# Altium schematic sheet one_planar_sensor_connector_hall_crossboard_1_1.SchDoc
size A3
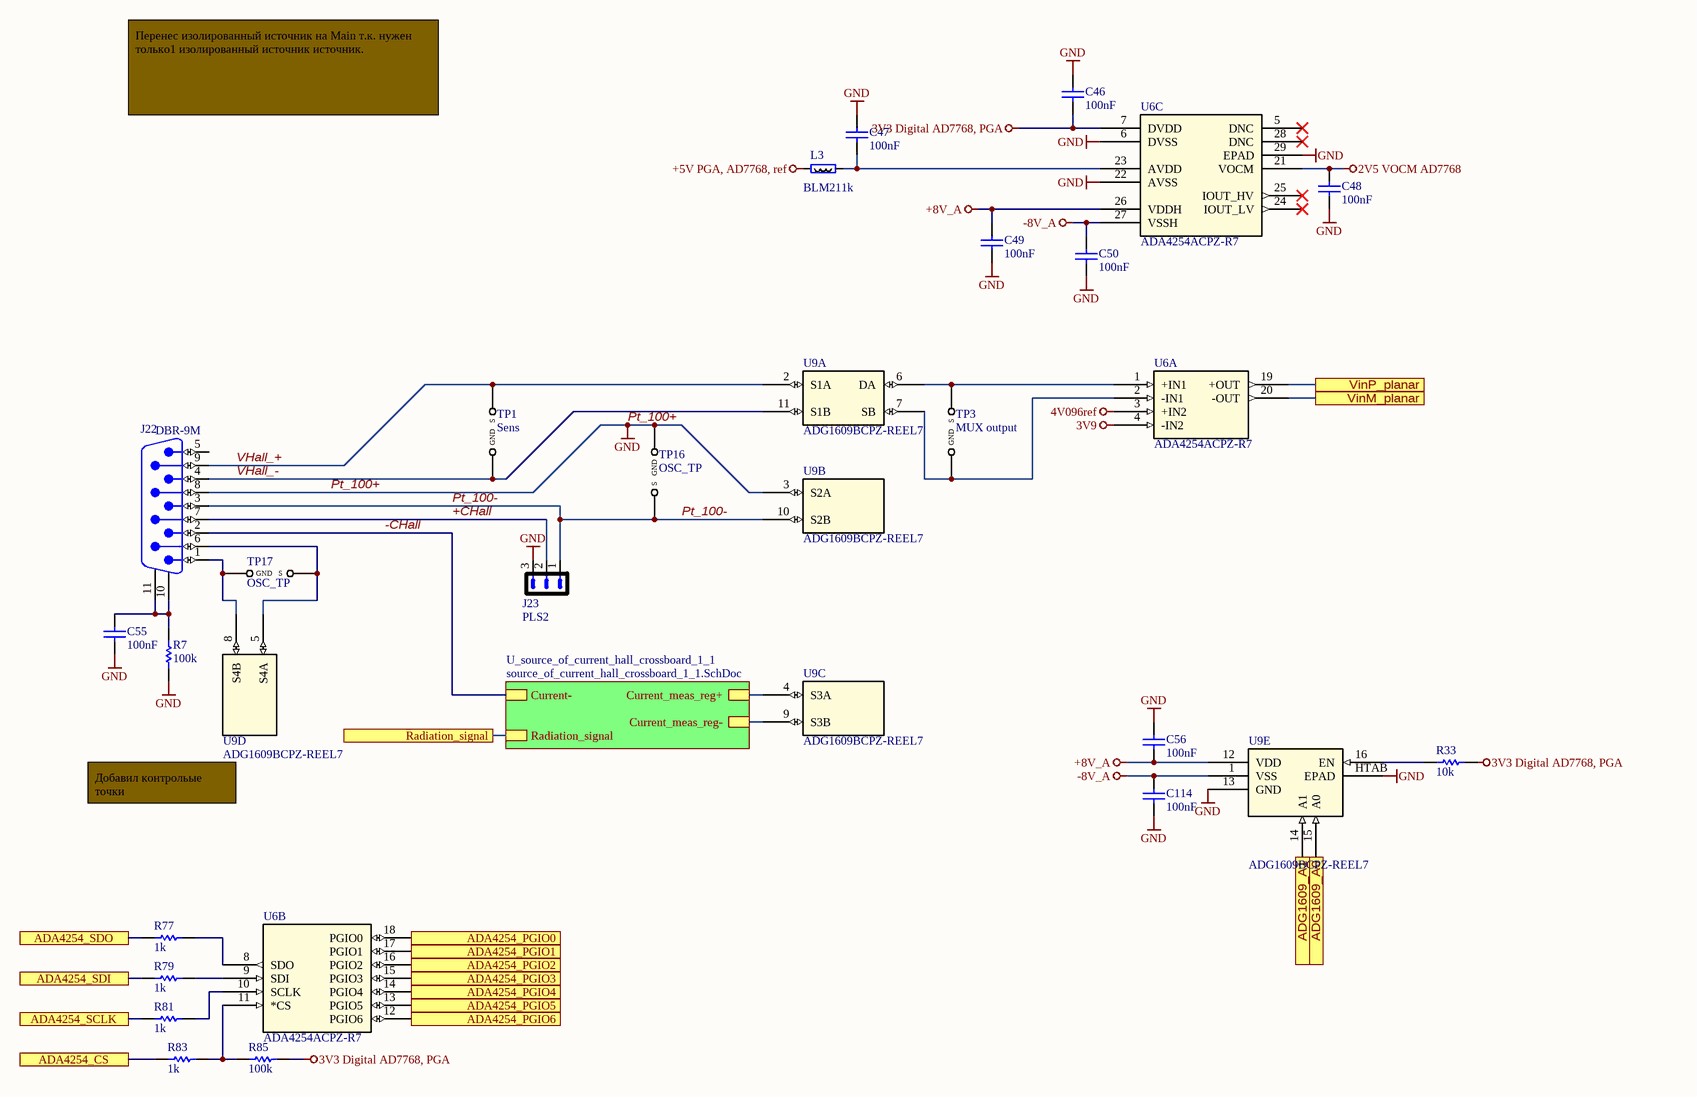
[diagram p0: one_planar_sensor_connector_hall_crossboard_1_1.SchDoc]

## Parts
C46  100nF  [0603C]
C47  100nF  [0603C]
C48  100nF  [0603C]
C49  100nF  [0603C]
C50  100nF  [0603C]
C55  100nF  [0603C]
C56  100nF  [0603C]
C114  100nF  [0603C]
J22  DBR-9M  [AMPHENOL_L717DFE09P1ATN]
J23  PLS2  [COMATEL_385.0358.1.03.400]
L3  BLM211k  [RESC2012X50N]
R7  100k  [0603R]
R33  10k  [0603R]
R77  1k  [0603R]
R79  1k  [0603R]
R81  1k  [0603R]
R83  1k  [0603R]
R85  100k  [0603R]
TP1  Sens  [TP2]
TP3  MUX output  [TP2]
TP16  OSC_TP  [TP2]
TP17  OSC_TP  [TP2]
U6  ADA4254ACPZ-R7  [CP-28-10_ADI-M]  (parts A,B,C of 3)
U9  ADG1609BCPZ-REEL7  [CP_16_22_ADI-M]  (parts A,B,C,D,E of 5)

## Sub-sheets
U_source_of_current_hall_crossboard_1_1 = source_of_current_hall_crossboard_1_1.SchDoc: Current-, Current_meas_reg+, Current_meas_reg-, Radiation_signal

## Ports
ADA4254_CS, ADA4254_PGIO0, ADA4254_PGIO1, ADA4254_PGIO2, ADA4254_PGIO3, ADA4254_PGIO4, ADA4254_PGIO5, ADA4254_PGIO6, ADA4254_SCLK, ADA4254_SDI, ADA4254_SDO, ADG1609_A0, ADG1609_A1, Radiation_signal, VinM_planar, VinP_planar

## Nets
2V5 VOCM AD7768: C48.2 U6.21(VOCM)
3V3 Digital AD7768, PGA: C46.1 R85.2 U6.7(DVDD)
3V9: U6.4(-IN2)
4V096ref: U6.3(+IN2)
+5V PGA, AD7768, ref: L3.1
+8V_A: C49.2 C56.1 U6.26(VDDH) U9.12(VDD)
-8V_A: C50.2 C114.2 U6.27(VSSH) U9.1(VSS)
Pt_100+: C46.2 C47.1 C48.1 C49.1 C50.1 C55.1 C56.2 C114.1 J22.8 J23.3 R7.1 TP16.2(GND) U6.6(DVSS) U6.22(AVSS) U6.29(EPAD) U9.3(S2A) U9.13(GND) U9.HTAB(EPAD)  [also labelled GND]
+CHall: J22.7 J23.2
-CHall: J22.2 ; sheet U_source_of_current_hall_crossboard_1_1/Current-
ADA4254_CS: R83.1 ; port ADA4254_CS
ADA4254_PGIO0: U6.18(PGIO0) ; port ADA4254_PGIO0
ADA4254_PGIO1: U6.17(PGIO1) ; port ADA4254_PGIO1
ADA4254_PGIO2: U6.16(PGIO2) ; port ADA4254_PGIO2
ADA4254_PGIO3: U6.15(PGIO3) ; port ADA4254_PGIO3
ADA4254_PGIO4: U6.14(PGIO4) ; port ADA4254_PGIO4
ADA4254_PGIO5: U6.13(PGIO5) ; port ADA4254_PGIO5
ADA4254_PGIO6: U6.12(PGIO6) ; port ADA4254_PGIO6
ADA4254_SCLK: R81.1 ; port ADA4254_SCLK
ADA4254_SDI: R79.1 ; port ADA4254_SDI
ADA4254_SDO: R77.1 ; port ADA4254_SDO
ADG1609_A0: U9.15(A0) ; port ADG1609_A0
ADG1609_A1: U9.14(A1) ; port ADG1609_A1
Pt_100-: J22.3 J23.1 TP16.1(S) U9.10(S2B)
Radiation_signal: port Radiation_signal, sheet U_source_of_current_hall_crossboard_1_1/Radiation_signal
VHall_+: J22.9 TP1.1(S) U9.2(S1A)
VHall_-: J22.4 TP1.2(GND) U9.11(S1B)
VinM_planar: U6.20(-OUT) ; port VinM_planar
VinP_planar: U6.19(+OUT) ; port VinP_planar
NetC47_2: C47.2 L3.2 U6.23(AVDD)
NetC55_2: C55.2 J22.10 J22.11 R7.2
NetJ22_1: J22.1 TP17.2(GND) U9.8(S4B)
NetJ22_6: J22.6 TP17.1(S) U9.5(S4A)
NetR33_1: R33.1 U9.16(EN)
NetR77_2: R77.2 U6.8(SDO)
NetR79_2: R79.2 U6.9(SDI)
NetR81_2: R81.2 U6.10(SCLK)
NetR83_2: R83.2 R85.1 U6.11(*CS)
NetTP3_1: TP3.1(S) U6.1(+IN1) U9.6(DA)
NetTP3_2: TP3.2(GND) U6.2(-IN1) U9.7(SB)
NetU9_4: U9.4(S3A) ; sheet U_source_of_current_hall_crossboard_1_1/Current_meas_reg+
NetU9_9: U9.9(S3B) ; sheet U_source_of_current_hall_crossboard_1_1/Current_meas_reg-

Not connected (* = marked no-connect by the designer): J22 5; R33 2; U6 5(DNC)* 24(IOUT_LV)* 25(IOUT_HV)* 28(DNC)*

## Notes on the sheet
- Перенес изолированный источник на Main т.к. нужен только1 изолированный источник источник.
- Добавил контрольые точки
- Labels drawn without touching a wire or pin: 3V3 Digital AD7768, PGA

## Library data of the parts
C46-C50 C55 C56 C114 = Capacitor_ST: Capacitor 0402 / 0603 / 0805; Revision: July-2002: Re-released for DXP Platform.; Value: 100nF
J22 = D_SUB_9M: Вилка  DSUB 9 угловая; Vendor: Connfly; SMD Solders: 0; Solder Option: RM; THD Solders: 11; Name to order: DRB- 9MA (DBR-9M) (DS1037-9M); Price: 50; Device: DBR-9M
J23 = PLS3: Vendor: Confly; SMD Solders: 0; Solder Option: RM; THD Solders: 2; Price: 1; Device: PLS2
L3 = BLM21: SMD Ferrite bead 0805; Vendor: Vishay; Value: 1k; Pkg: SMD0805; SMD Solders: 2; Solder Option: RM; Device: BLM21; Price: 10
R7 R33 R77 R79 R81 R83 R85 = Resistor_ST: Resistor 0402 / 0603 / 0805
  R7 R85: Value: 100k
  R33: Value: 10k
  R77 R79 R81 R83: Value: 1k
TP1 TP3 TP16 TP17 = OscTP: Контрольная точка для подключения осциллографа короткой землёй; Vendor: PCB; Price: 0; SolderOption: PCB
  TP1: Value: Sens
  TP3: Value: MUX output
  TP16 TP17: Value: OSC_TP
U6 = ADA4254ACPZ-R7: No Description Available; Mfr_Name: Analog Devices Inc; Digi-Key_Part_Number_1: 505-ADA4254ACPZ-R7TR-ND; RefDes: RefDes; Type: Type
U9 = ADG1609BCPZ-REEL7: No Description Available; Mfr_Name: Analog Devices Inc; RefDes: RefDes; Type: Type